# Altium schematic sheet EtherNet.SchDoc
size A4
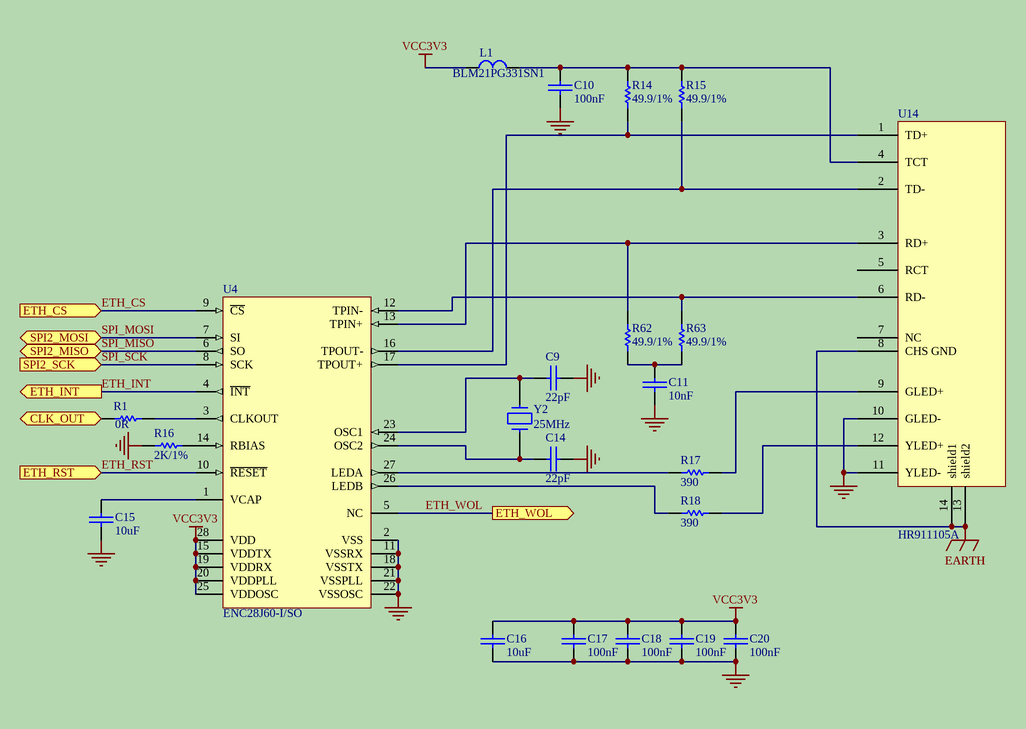
[diagram p0: EtherNet.SchDoc]

## Parts
C9  22pF  [C0805]
C10  100nF  [C0805]
C11  10nF  [C0805]
C14  22pF  [C0805]
C15  10uF  [C1206]
C16  10uF  [C1206]
C17  100nF  [C0805]
C18  100nF  [C0805]
C19  100nF  [C0805]
C20  100nF  [C0805]
L1  BLM21PG331SN1  [L0805]
R1  0R  [R0805]
R14  49.9/1%  [R0805]
R15  49.9/1%  [R0805]
R16  2K/1%  [R0805]
R17  390  [R0805]
R18  390  [R0805]
R62  49.9/1%  [R0805]
R63  49.9/1%  [R0805]
U4  ENC28J60-I/SO  [SOIC-SO28_L]
U14  HR911105A  [HANRUN-A8]
Y2  25MHz  [CRYSTAL2]

## Ports
CLK_OUT (in), ETH_CS (in), ETH_INT (out), ETH_RST (in), ETH_WOL (out), SPI2_MISO, SPI2_MOSI, SPI2_SCK (in)

## Nets
EARTH: U14.8(CHS_GND) U14.13(shield2) U14.14(shield1)
GND: C9.2 C10.1 C11.1 C14.2 C15.1 C16.1 C17.1 C18.1 C19.1 C20.1 R16.1 U4.2(VSS) U4.11(VSSRX) U4.18(VSSTX) U4.21(VSSPLL) U4.22(VSSOSC) U14.10(GLED-) U14.11(YLED-)
VCC3V3: C16.2 C17.2 C18.2 C19.2 C20.2 L1.1 U4.15(VDDTX) U4.19(VDDRX) U4.20(VDDPLL) U4.25(VDDOSC) U4.28(VDD)
CLK_OUT: R1.1 ; port CLK_OUT
ETH_CS: U4.9(~{CS}) ; port ETH_CS
ETH_INT: U4.4(~{INT}) ; port ETH_INT
ETH_RST: U4.10(~{RESET}) ; port ETH_RST
ETH_WOL: U4.5(NC) ; port ETH_WOL
SPI_MISO: U4.6(SO) ; port SPI2_MISO
SPI_MOSI: U4.7(SI) ; port SPI2_MOSI
SPI_SCK: U4.8(SCK) ; port SPI2_SCK
NetC9_1: C9.1 U4.23(OSC1) Y2.1
NetC10_2: C10.2 L1.2 R14.1 R15.1 U14.4(TCT)
NetC11_2: C11.2 R62.1 R63.1
NetC14_1: C14.1 U4.24(OSC2) Y2.2
NetC15_2: C15.2 U4.1(VCAP)
NetR1_2: R1.2 U4.3(CLKOUT)
NetR14_2: R14.2 U4.17(TPOUT+) U14.1(TD+)
NetR15_2: R15.2 U4.16(TPOUT-) U14.2(TD-)
NetR16_2: R16.2 U4.14(RBIAS)
NetR17_1: R17.1 U14.9(GLED+)
NetR17_2: R17.2 U4.27(LEDA)
NetR18_1: R18.1 U14.12(YLED+)
NetR18_2: R18.2 U4.26(LEDB)
NetR62_2: R62.2 U4.13(TPIN+) U14.3(RD+)
NetR63_2: R63.2 U4.12(TPIN-) U14.6(RD-)

Not connected (* = marked no-connect by the designer): U14 5(RCT) 7(NC)

## Library data of the parts
C9-C11 C14-C20 = CAP: Capacitor
L1 = L1
R1 R14-R18 R62 R63 = Res1: Resistor; Value: 1K; Published: 8-Jun-2000; LatestRevisionDate: 17-Jul-2002; LatestRevisionNote: Re-released for DXP Platform.; PackageReference: AXIAL-0.3; Publisher: Altium Limited
U4 = ENC28J60/SO: Stand-Alone Ethernet Controller with SPI Interface, 28-Pin SOIC; Published: 29-Jan-2009; DatasheetVersion: RevC, Jan-2008; PackageVersion: revAW, Oct-2008; PackageReference: SOIC-SO28; Publisher: Altium Limited; PackageDescription: 28-Lead Plastic Small Outline (SO) - Wide 7.50mm Body [SOIC]; Code_JEDEC: MS-013; ComponentLink1Description: Manufacturer Link; ComponentLink1URL: http://www.microchip.com; ComponentLink2Description: Datasheet; ComponentLink2URL: http://ww1.microchip.com/downloads/en/DeviceDoc/39662c.pdf; ComponentLink3Description: Packaging Specification; ComponentLink3URL: http://ww1.microchip.com/downloads/en/PackagingSpec/00049AW.pdf
U14 = HR911105A: RJ45 Connector with Integrated Magnetics; Text Field1: 80; Text Field2: 270
Y2 = CRYSTAL